# Altium schematic sheet ThermometerMain.SchDoc
size A; SheetNumber: 1; SheetTotal: 1
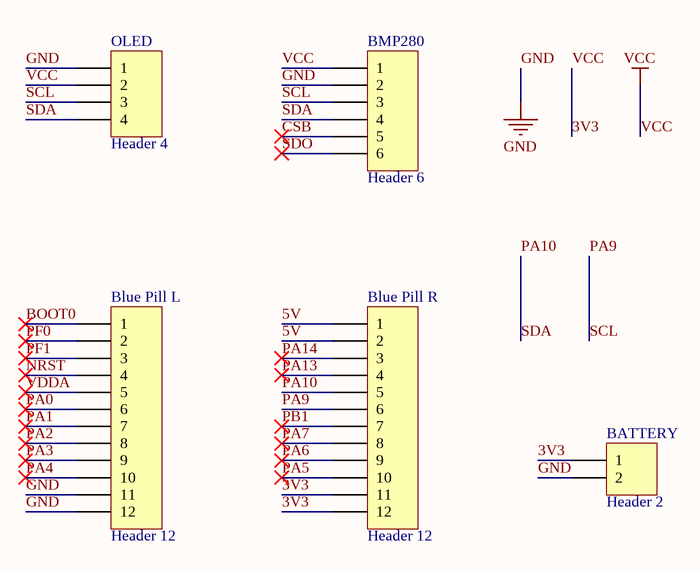
[diagram p0: ThermometerMain.SchDoc]

## Parts
BATTERY  Header 2  [HDR1X2]
Blue_Pill_L  Header 12  [HDR1X12]
Blue_Pill_R  Header 12  [HDR1X12]
BMP280  Header 6  [HDR1X6]
OLED  Header 4  [HDR1X4]

## Nets
3V3: BATTERY.1 Blue_Pill_R.11 Blue_Pill_R.12 BMP280.1 OLED.2  [also labelled VCC]
GND: BATTERY.2 Blue_Pill_L.11 Blue_Pill_L.12 BMP280.2 OLED.1
5V: Blue_Pill_R.1 Blue_Pill_R.2
BOOT0: Blue_Pill_L.1
CSB: BMP280.5
NRST: Blue_Pill_L.4
PA0: Blue_Pill_L.6
PA1: Blue_Pill_L.7
PA2: Blue_Pill_L.8
PA3: Blue_Pill_L.9
PA4: Blue_Pill_L.10
PA5: Blue_Pill_R.10
PA6: Blue_Pill_R.9
PA7: Blue_Pill_R.8
PA9: Blue_Pill_R.6 BMP280.3 OLED.3  [also labelled SCL]
PA10: Blue_Pill_R.5 BMP280.4 OLED.4  [also labelled SDA]
PA13: Blue_Pill_R.4
PA14: Blue_Pill_R.3
PB1: Blue_Pill_R.7
PF0: Blue_Pill_L.2
PF1: Blue_Pill_L.3
SDO: BMP280.6
VDDA: Blue_Pill_L.5

## Library data of the parts
BATTERY = Header 2: Header, 2-Pin; LatestRevisionDate: 17-Jul-2002; LatestRevisionNote: Re-released for DXP Platform.; Publisher: Altium Limited
Blue_Pill_L Blue_Pill_R = Header 12: Header, 12-Pin; LatestRevisionDate: 17-Jul-2002; LatestRevisionNote: Re-released for DXP Platform.; Publisher: Altium Limited
BMP280 = Header 6: Header, 6-Pin; LatestRevisionDate: 17-Jul-2002; LatestRevisionNote: Re-released for DXP Platform.; Publisher: Altium Limited
OLED = Header 4: Header, 4-Pin; LatestRevisionDate: 17-Jul-2002; LatestRevisionNote: Re-released for DXP Platform.; Publisher: Altium Limited